# EAGLE schematic comm (EAGLE 9.1.3)
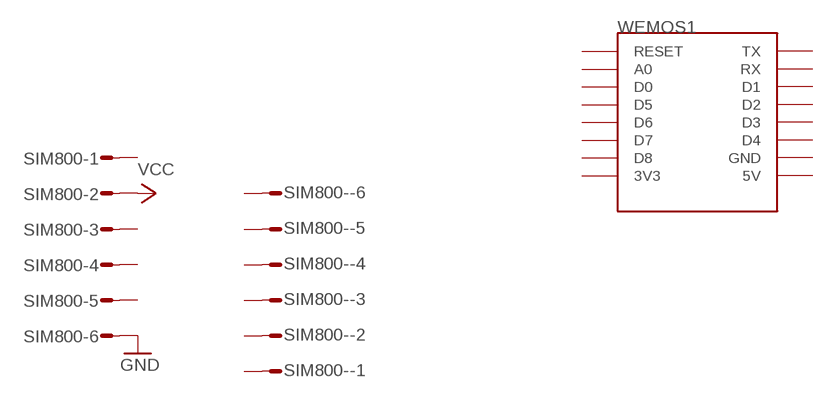
[diagram p0: schematic, sheet 1]

## Parts
SIM800  M06S  [06P]
SIM800-  M06S  [06P]
WEMOS1  WEMOS-D1-MINI  [WEMOS-D1-MINI]

## Nets
GND: SIM800.6
VCC: SIM800.2
Unconnected: SIM800-.1 SIM800-.2 SIM800-.3 SIM800-.4 SIM800-.5 SIM800-.6 SIM800.1 SIM800.3 SIM800.4 SIM800.5 WEMOS1.3V3 WEMOS1.5V WEMOS1.A0 WEMOS1.D0 WEMOS1.D1 WEMOS1.D2 WEMOS1.D3 WEMOS1.D4 WEMOS1.D5 WEMOS1.D6 WEMOS1.D7 WEMOS1.D8 WEMOS1.GND WEMOS1.RESET WEMOS1.RX WEMOS1.TX

## Library data of the parts
SIM800 SIM800- = con-amp-quick:M06S: AMP QUICK CONNECTOR; OC_FARNELL: unknown; OC_NEWARK: unknown
WEMOS1 = esp8266modules:WEMOS-D1-MINI: WeMos.cc D1 mini ESP8266 module